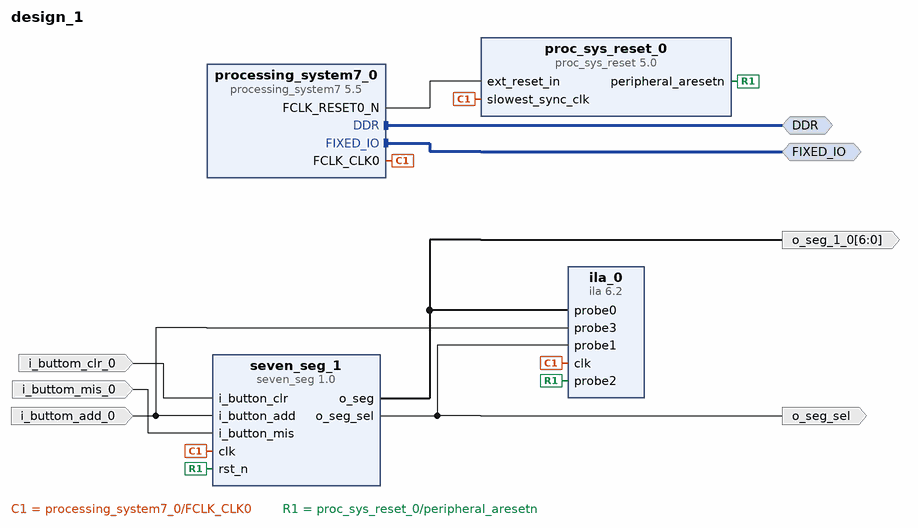
[diagram p0: block diagram of the top level]
# Vivado block design design_1, xc7z020clg484-1, Vivado 2019.2
create_bd_design design_1

create_bd_intf_port -mode Master -vlnv xilinx.com:interface:ddrx_rtl:1.0 DDR
create_bd_intf_port -mode Master -vlnv xilinx.com:display_processing_system7:fixedio_rtl:1.0 FIXED_IO
create_bd_port -dir I i_buttom_add_0
create_bd_port -dir I i_buttom_mis_0
create_bd_port -dir I i_buttom_clr_0
create_bd_port -dir O -from 6 -to 0 o_seg_1_0
create_bd_port -dir O o_seg_sel

create_bd_cell -type ip -vlnv xilinx.com:ip:ila:6.2 ila_0
set_property -dict [list \
  CONFIG.C_ENABLE_ILA_AXI_MON false \
  CONFIG.C_MONITOR_TYPE Native \
  CONFIG.C_NUM_OF_PROBES 4 \
  CONFIG.C_PROBE0_WIDTH 7 \
  CONFIG.C_PROBE1_WIDTH 1 \
] [get_bd_cells ila_0]
create_bd_cell -type ip -vlnv xilinx.com:ip:processing_system7:5.5 processing_system7_0
set_property -dict {CONFIG.PCW_FPGA0_PERIPHERAL_FREQMHZ 10 CONFIG.PCW_USE_M_AXI_GP0 0} [get_bd_cells processing_system7_0]
# 31 more settings of processing_system7_0 are not shown: defaults, MIO pin electricals, DDR timing, and values the tool derives
create_bd_cell -type ip -vlnv xilinx.com:ip:proc_sys_reset:5.0 proc_sys_reset_0
create_bd_cell -type ip -vlnv xilinx.com:user:seven_seg:1.0 seven_seg_1

# ---- connections ----

connect_bd_intf_net [get_bd_intf_ports FIXED_IO] [get_bd_intf_pins processing_system7_0/FIXED_IO]
connect_bd_intf_net [get_bd_intf_ports DDR] [get_bd_intf_pins processing_system7_0/DDR]
connect_bd_net -net clk_wiz_clk_out1 [get_bd_pins processing_system7_0/FCLK_CLK0] \
  [get_bd_pins ila_0/clk] [get_bd_pins proc_sys_reset_0/slowest_sync_clk] [get_bd_pins seven_seg_1/clk]
connect_bd_net -net i_buttom_add_0_1 [get_bd_ports i_buttom_add_0] [get_bd_pins ila_0/probe3] [get_bd_pins seven_seg_1/i_button_add]
connect_bd_net -net i_buttom_clr_0_1 [get_bd_ports i_buttom_clr_0] [get_bd_pins seven_seg_1/i_button_clr]
connect_bd_net -net i_buttom_mis_0_1 [get_bd_ports i_buttom_mis_0] [get_bd_pins seven_seg_1/i_button_mis]
connect_bd_net -net rst_n_0_1 [get_bd_pins proc_sys_reset_0/peripheral_aresetn] [get_bd_pins ila_0/probe2] [get_bd_pins seven_seg_1/rst_n]
connect_bd_net [get_bd_pins processing_system7_0/FCLK_RESET0_N] [get_bd_pins proc_sys_reset_0/ext_reset_in]
connect_bd_net [get_bd_pins seven_seg_1/o_seg] [get_bd_ports o_seg_1_0] [get_bd_pins ila_0/probe0]
connect_bd_net [get_bd_pins seven_seg_1/o_seg_sel] [get_bd_pins ila_0/probe1] [get_bd_ports o_seg_sel]

validate_bd_design
save_bd_design
